# Altium schematic sheet Zynq config, JTAG, Debug.SchDoc
size A2; SheetNumber: 4; SheetTotal: 11
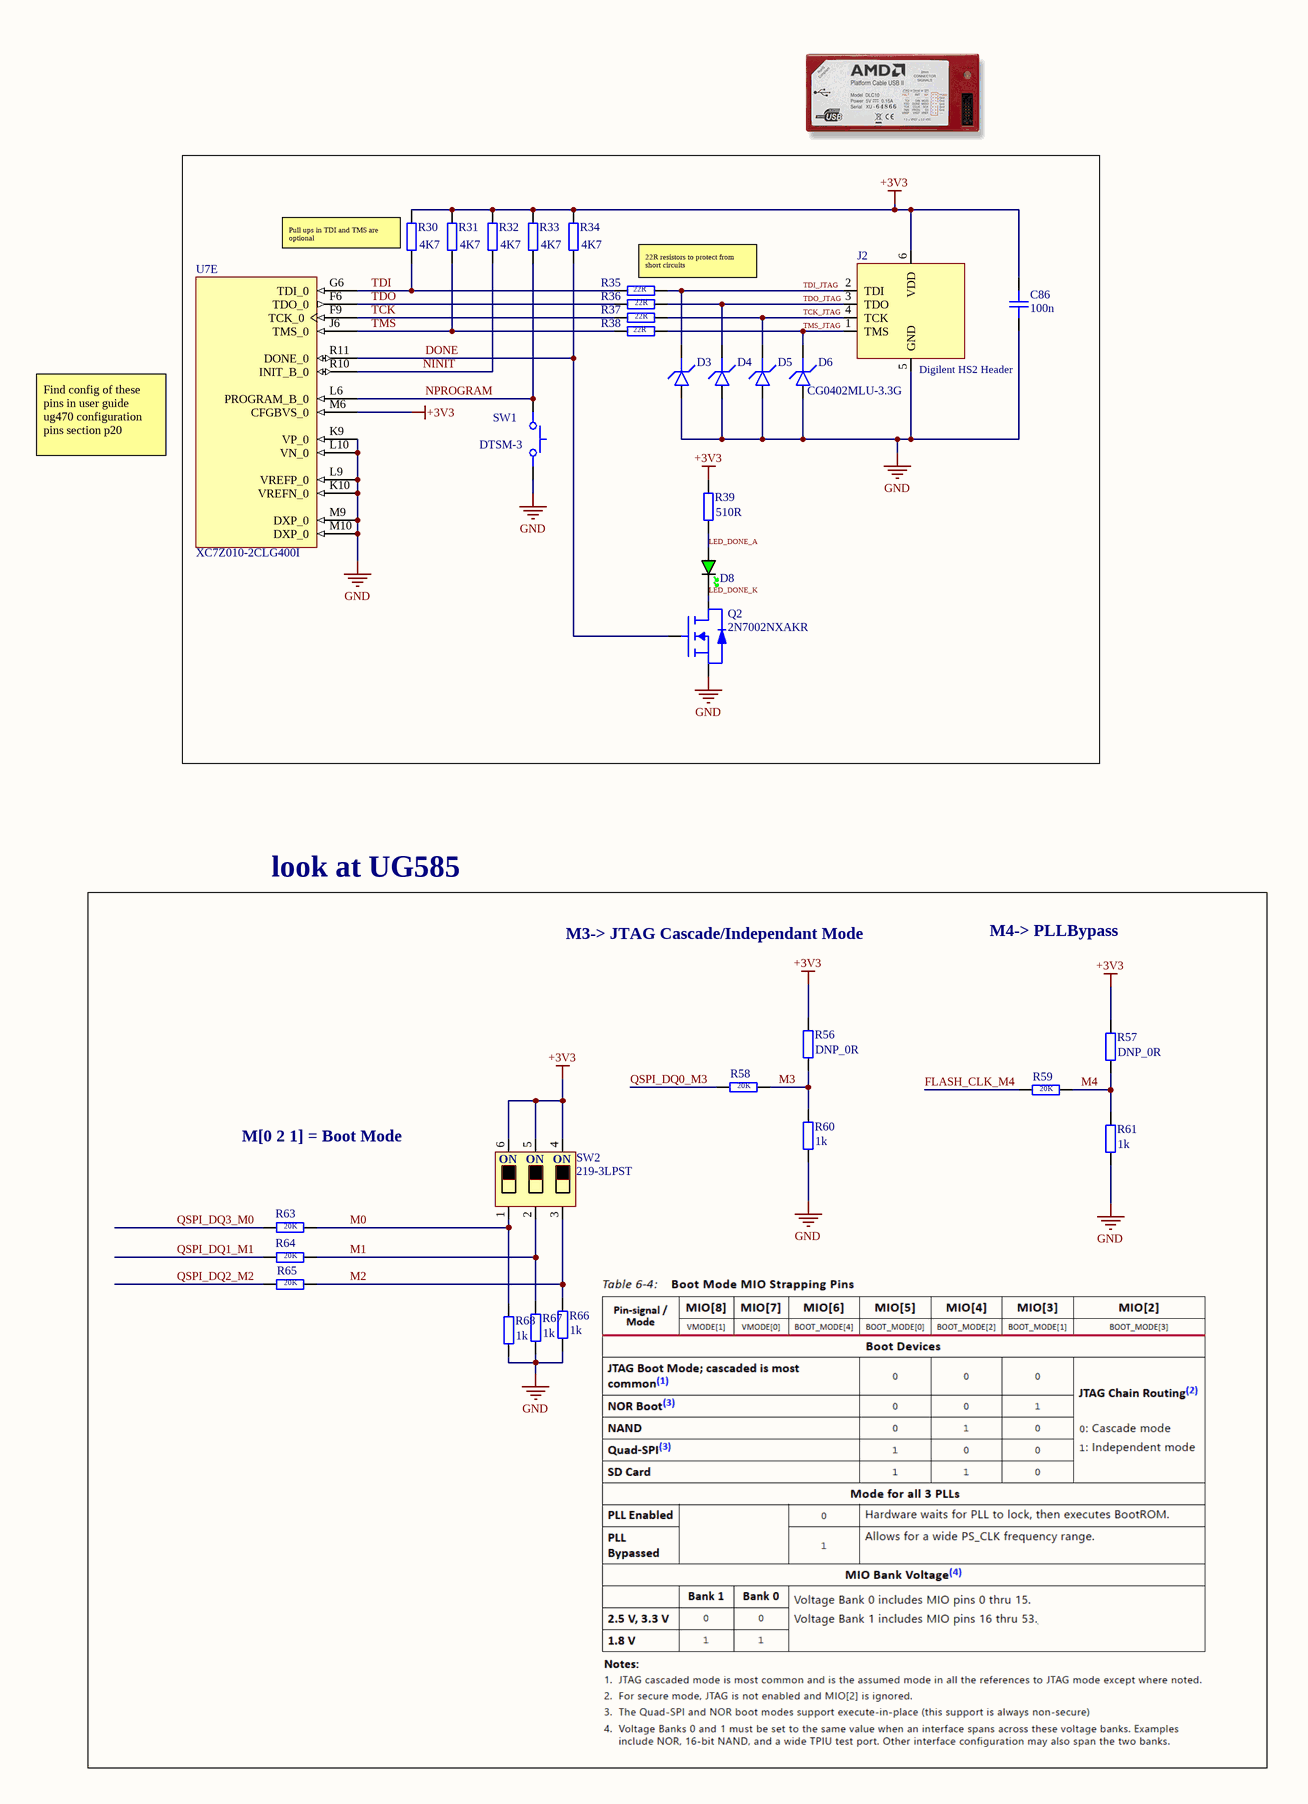
[diagram p0: Zynq config, JTAG, Debug.SchDoc, left]
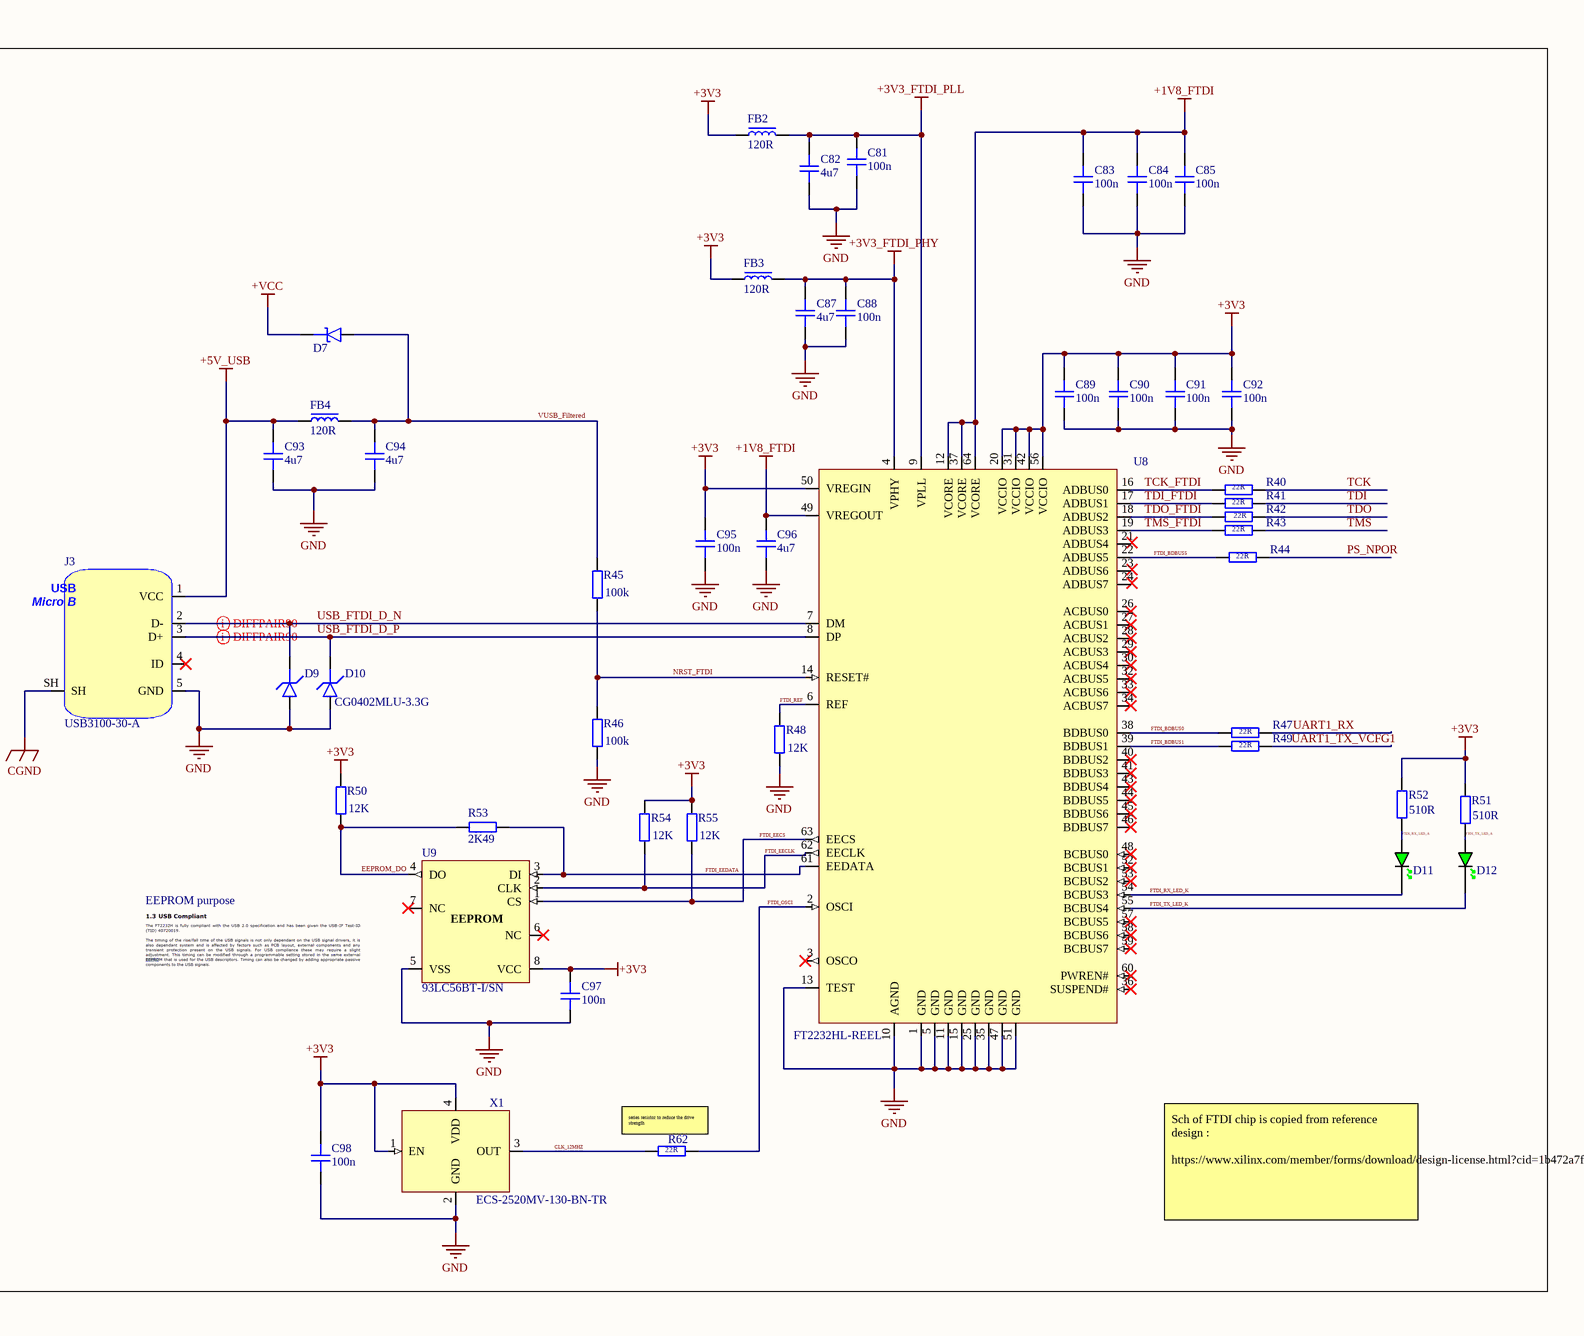
[diagram p1: Zynq config, JTAG, Debug.SchDoc, right]

## Parts
C81  100n  [CAP_0402]
C82  4u7  [CAP_0402]
C83  100n  [CAP_0402]
C84  100n  [CAP_0402]
C85  100n  [CAP_0402]
C86  100n  [CAP_0402]
C87  4u7  [CAP_0402]
C88  100n  [CAP_0402]
C89  100n  [CAP_0402]
C90  100n  [CAP_0402]
C91  100n  [CAP_0402]
C92  100n  [CAP_0402]
C93  4u7  [CAP_0402]
C94  4u7  [CAP_0402]
C95  100n  [CAP_0402]
C96  4u7  [CAP_0402]
C97  100n  [CAP_0402]
C98  100n  [CAP_0402]
D3  D_TVS_0402  [D_0402]  (value not drawn)
D4  D_TVS_0402  [D_0402]  (value not drawn)
D5  D_TVS_0402  [D_0402]  (value not drawn)
D6  Designator: CG0402MLU-3.3G  [D_0402]  (hidden comment: D_TVS_0402)
D7  D_SCHOTTKY_SOD_323  [SOD-323]  (value not drawn)
D8  GREEN  [LED_0402_GREEN]  (value not drawn)
D9  D_TVS_0402  [D_0402]  (value not drawn)
D10  Designator: CG0402MLU-3.3G  [D_0402]  (hidden comment: D_TVS_0402)
D11  GREEN  [LED_0402_GREEN]  (value not drawn)
D12  GREEN  [LED_0402_GREEN]  (value not drawn)
FB2  120R  [FB_0402]
FB3  120R  [FB_0402]
FB4  120R  [FB_0402]
J2  Digilent HS2 Header  [DIGILENT_HS2]
J3  USB3100-30-A  [USB3100-30-A]
Q2  2N7002NXAKR  [SSM3J338R,LF-SOT23-F]
R30  value 4K7  [RES_0402]  (hidden comment: R0402)
R31  value 4K7  [RES_0402]  (hidden comment: R0402)
R32  value 4K7  [RES_0402]  (hidden comment: R0402)
R33  value 4K7  [RES_0402]  (hidden comment: R0402)
R34  value 4K7  [RES_0402]  (hidden comment: R0402)
R35  value 22R  [RES_0402]  (hidden comment: R0402)
R36  value 22R  [RES_0402]  (hidden comment: R0402)
R37  value 22R  [RES_0402]  (hidden comment: R0402)
R38  value 22R  [RES_0402]  (hidden comment: R0402)
R39  value 510R  [RES_0402]  (hidden comment: R0402)
R40  value 22R  [RES_0402]  (hidden comment: R0402)
R41  value 22R  [RES_0402]  (hidden comment: R0402)
R42  value 22R  [RES_0402]  (hidden comment: R0402)
R43  value 22R  [RES_0402]  (hidden comment: R0402)
R44  value 22R  [RES_0402]  (hidden comment: R0402)
R45  value 100k  [RES_0402]  (hidden comment: R0402)
R46  value 100k  [RES_0402]  (hidden comment: R0402)
R47  value 22R  [RES_0402]  (hidden comment: R0402)
R48  value 12K  [RES_0402]  (hidden comment: R0402)
R49  value 22R  [RES_0402]  (hidden comment: R0402)
R50  value 12K  [RES_0402]  (hidden comment: R0402)
R51  value 510R  [RES_0402]  (hidden comment: R0402)
R52  value 510R  [RES_0402]  (hidden comment: R0402)
R53  value 2K49  [RES_0402]  (hidden comment: R0402)
R54  value 12K  [RES_0402]  (hidden comment: R0402)
R55  value 12K  [RES_0402]  (hidden comment: R0402)
R56  value DNP_0R  [RES_0402]  (hidden comment: R0402)
R57  value DNP_0R  [RES_0402]  (hidden comment: R0402)
R58  value 20K  [RES_0402]  (hidden comment: R0402)
R59  value 20K  [RES_0402]  (hidden comment: R0402)
R60  value 1k  [RES_0402]  (hidden comment: R0402)
R61  value 1k  [RES_0402]  (hidden comment: R0402)
R62  value 22R  [RES_0402]  (hidden comment: R0402)
R63  value 20K  [RES_0402]  (hidden comment: R0402)
R64  value 20K  [RES_0402]  (hidden comment: R0402)
R65  value 20K  [RES_0402]  (hidden comment: R0402)
R66  value 1k  [RES_0402]  (hidden comment: R0402)
R67  value 1k  [RES_0402]  (hidden comment: R0402)
R68  value 1k  [RES_0402]  (hidden comment: R0402)
SW1  DTSM-3  [DTSM-3]
SW2  219-3LPST  [219-3LPST]
U7  XC7Z010-2CLG400I  [BGA400C80P20X20_1700X1700X160N]  (part E of 9)
U8  FT2232HL-REEL  [LQFP-64-0.5mm]
U9  93LC56BT-I/SN  [SOIC-8]
X1  ECS-2520MV-130-BN-TR  [XTAL_2520]

## Blocks framed on the sheet
look at UG585: R56-R61 R63-R68 SW2

## Nets
+1V8_FTDI: C83.2 C84.2 C85.2 C96.2 U8.12(VCORE) U8.37(VCORE) U8.49(VREGOUT) U8.64(VCORE)
+3V3: C86.2 C89.2 C90.2 C91.2 C92.2 C95.2 C97.2 C98.2 FB2.1 FB3.1 J2.6(VDD) R30.2 R31.2 R32.2 R33.2 R34.2 R39.1 R50.2 R51.1 R52.1 R54.2 R55.2 R56.1 R57.1 SW2.4 SW2.5 SW2.6 U7.M6(CFGBVS_0) U8.20(VCCIO) U8.31(VCCIO) U8.42(VCCIO) U8.50(VREGIN) U8.56(VCCIO) U9.8(VCC) X1.1(EN) X1.4(VDD)
+3V3_FTDI_PHY: C87.2 C88.2 FB3.2 U8.4(VPHY)
+3V3_FTDI_PLL: C81.2 C82.2 FB2.2 U8.9(VPLL)
+5V_USB: C93.2 FB4.1 J3.1(VCC)
+VCC: D7.K
CGND: J3.SH
GND: C81.1 C82.1 C83.1 C84.1 C85.1 C86.1 C87.1 C88.1 C89.1 C90.1 C91.1 C92.1 C93.1 C94.1 C95.1 C96.1 C97.1 C98.1 D3.A D4.A D5.A D6.A D9.A D10.A J2.5(GND) J3.5(GND) Q2.S R46.1 R48.1 R60.2 R61.2 R66.2 R67.2 R68.2 SW1.2 U7.K9(VP_0) U7.K10(VREFN_0) U7.L9(VREFP_0) U7.L10(VN_0) U7.M9(DXP_0) U7.M10(DXP_0) U8.1(GND) U8.5(GND) U8.10(AGND) U8.11(GND) U8.13(TEST) U8.15(GND) U8.25(GND) U8.35(GND) U8.47(GND) U8.51(GND) U9.5(VSS) X1.2(GND)
CLK_12MHZ: R62.1 X1.3(OUT)
DONE: Q2.G R34.1 U7.R11(DONE_0)
EEPROM_DO: R50.1 R53.2 U9.4(DO)
FLASH_CLK_M4: R59.1
FTDI_BDBUS0: R47.1 U8.38(BDBUS0)
FTDI_BDBUS1: R49.1 U8.39(BDBUS1)
FTDI_BDBUS5: R44.1 U8.22(ADBUS5)
FTDI_EECLK: R54.1 U8.62(EECLK) U9.2(CLK)
FTDI_EECS: R55.1 U8.63(EECS) U9.1(CS)
FTDI_EEDATA: R53.1 U8.61(EEDATA) U9.3(DI)
FTDI_OSCI: R62.2 U8.2(OSCI)
FTDI_REF: R48.2 U8.6(REF)
FTDI_RX_LED_A: D11.A R52.2
FTDI_RX_LED_K: D11.K U8.54(BCBUS3)
FTDI_TX_LED_A: D12.A R51.2
FTDI_TX_LED_K: D12.K U8.55(BCBUS4)
LED_DONE_A: D8.A R39.2
LED_DONE_K: D8.K Q2.D
M0: R63.2 R68.1 SW2.1
M1: R64.2 R67.1 SW2.2
M2: R65.2 R66.1 SW2.3
M3: R56.2 R58.2 R60.1
M4: R57.2 R59.2 R61.1
NINIT: R32.1 U7.R10(INIT_B_0)
NPROGRAM: R33.1 SW1.1 U7.L6(PROGRAM_B_0)
NRST_FTDI: R45.1 R46.2 U8.14(RESET#)
PS_NPOR: R44.2
QSPI_DQ0_M3: R58.1
QSPI_DQ1_M1: R64.1
QSPI_DQ2_M2: R65.1
QSPI_DQ3_M0: R63.1
TCK: R37.2 R40.2 U7.F9(TCK_0)
TCK_FTDI: R40.1 U8.16(ADBUS0)
TCK_JTAG: D5.K J2.4(TCK) R37.1
TDI: R30.1 R35.2 R41.2 U7.G6(TDI_0)
TDI_FTDI: R41.1 U8.17(ADBUS1)
TDI_JTAG: D3.K J2.2(TDI) R35.1
TDO: R36.2 R42.2 U7.F6(TDO_0)
TDO_FTDI: R42.1 U8.18(ADBUS2)
TDO_JTAG: D4.K J2.3(TDO) R36.1
TMS: R31.1 R38.2 R43.2 U7.J6(TMS_0)
TMS_FTDI: R43.1 U8.19(ADBUS3)
TMS_JTAG: D6.K J2.1(TMS) R38.1
UART1_RX: R47.2
UART1_TX_VCFG1: R49.2
USB_FTDI_D_N: D9.K J3.2(D-) U8.7(DM)
USB_FTDI_D_P: D10.K J3.3(D+) U8.8(DP)
VUSB_Filtered: C94.2 D7.A FB4.2 R45.2

Not connected (* = marked no-connect by the designer): J3 4(ID)*; U8 3(OSCO)* 21(ADBUS4) 23(ADBUS6) 24(ADBUS7) 26(ACBUS0)* 27(ACBUS1)* 28(ACBUS2)* 29(ACBUS3)* 30(ACBUS4)* 32(ACBUS5)* 33(ACBUS6)* 34(ACBUS7)* 36(SUSPEND#)* 40(BDBUS2)* 41(BDBUS3)* 43(BDBUS4)* 44(BDBUS5)* 45(BDBUS6)* 46(BDBUS7)* 48(BCBUS0)* 52(BCBUS1)* 53(BCBUS2)* 57(BCBUS5)* 58(BCBUS6)* 59(BCBUS7)* 60(PWREN#)*; U9 6(NC)* 7(NC)*

## Layout directives
differential pair; differential pair class 90OHM: USB_FTDI_D_N, USB_FTDI_D_P

## Notes on the sheet
- (near R30) Pull ups in TDI and TMS are optional
- (near R35) 22R resistors to protect from short circuits
- Find config of these pins in user guide ug470 configuration pins section p20
- M3-> JTAG Cascade/Independant Mode
- M4-> PLLBypass
- EEPROM purpose
- (near U9) EEPROM
- M[0 2 1] = Boot Mode
- (near R62) series resistor to reduce the drive strength
- Sch of FTDI chip is copied from reference design :
  https://www.xilinx.com/member/forms/download/design-license.html?cid=1b472a7f-089f-495e-97cb-68bcb4cceec8&filename=vck190-schematic-xtp610.zip
- (in symbol 219-3LPST) ON
- (in symbol USB3100-30-A) USB; Micro B

## Library data of the parts
C81-C98 = CAP_0402: Capacitor SMD 0402; Manufacturer: *; Manufacturer Part Number: *; Distributor Link: *; LCSC: *; Rating: *; Dielectric: *
  C81-C85 C87-C98: package: 0402
D3-D5 D9 = D_TVS_0402: Diode TVS / ESD 0402; Designator: CG0402MLU-3.3G
D6 D10 = D_TVS_0402: Diode TVS / ESD 0402
D7 = D_SCHOTTKY_SOD_323: Diode Schottky SMD SOD-323
D8 D11 D12 = LED_0402_GREEN: LED 0402 GREEN SMD
FB2-FB4 = FB_0402: Ferrite Bead SMD 0402; Manufacturer: *; Manufacturer Part Number: *; Distributor Link: *; LCSC: *
J2 = Digilent_HS2_Header: Digilent HS2 6-Pin 2.54mm Pitch Header; Manufacturer: Amphenol FCI; Manufacturer Part Number: 68000-406HLF
J3 = USB3100-30-A: USB Connector Type Micro B 2.0 SMD Reverse Mount; Manufacturer: GCT; Manufacturer Part Number: USB3100-30-A
Q2 = 2N7002NXAKR: MOSFET N-Channel Vds=60V Id=300mA with ESD Protection; Manufacturer: Nexperia; Manufacturer Part Number: 2N7002NXAKR
R30-R68 = RES_0402: Resistor SMD 0402; Manufacturer: *; Manufacturer Part Number: *; Distributor Link: *; LCSC: *
SW1 = DTSM-3: Tactile Switch SMD SPST; Manufacturer: Diptronics; Manufacturer Part Number: DTSM-3
SW2 = 219-3LPST: DIP Switches SPST 3x; Manufacturer: CTS; Manufacturer Part Number: 219-3LPST
U8 = FT2232HL-REEL: Hi-Speed Dual USB UART/FIFO IC; Manufacturer: FTDI; Manufacturer Part Number: FT2232HL-REEL; Distributor Link: https://www.mouser.de/ProductDetail/FTDI/FT2232HL-REEL?qs=D1%2FPMqvA100v7FHcEx164g%3D%3D; LCSC: C27882
U9 = 93LC56BT-I/SN: 2K Microwire Compatible Serial EEPROM; Manufacturer: Microchip; Manufacturer Part Number: 93LC56BT-I/SN; Distributor Link: https://www.mouser.de/ProductDetail/Microchip-Technology/93LC56BT-I-SN?qs=lQv0JY93vreW%252BBssv4v8RA%3D%3D; LCSC: C6164
X1 = ECS-2520MV-130-BN-TR: Standard Clock Oscillators XO (Standard),13MHz,Standby (Power Down),CMOS, Multi-Volt,1.6 V 3.6 V,+/-50ppm,-40 C 85 C,6mA,Surface Mount,4-SMD, No Lead,(2.50mm x 2.00mm),(0.80mm); Manufacturer: ECS; Manufacturer Part Number: ECS-2520MV-130-BN-TR